# Altium schematic sheet LWIR_FPGA_CSI.SchDoc
size A4
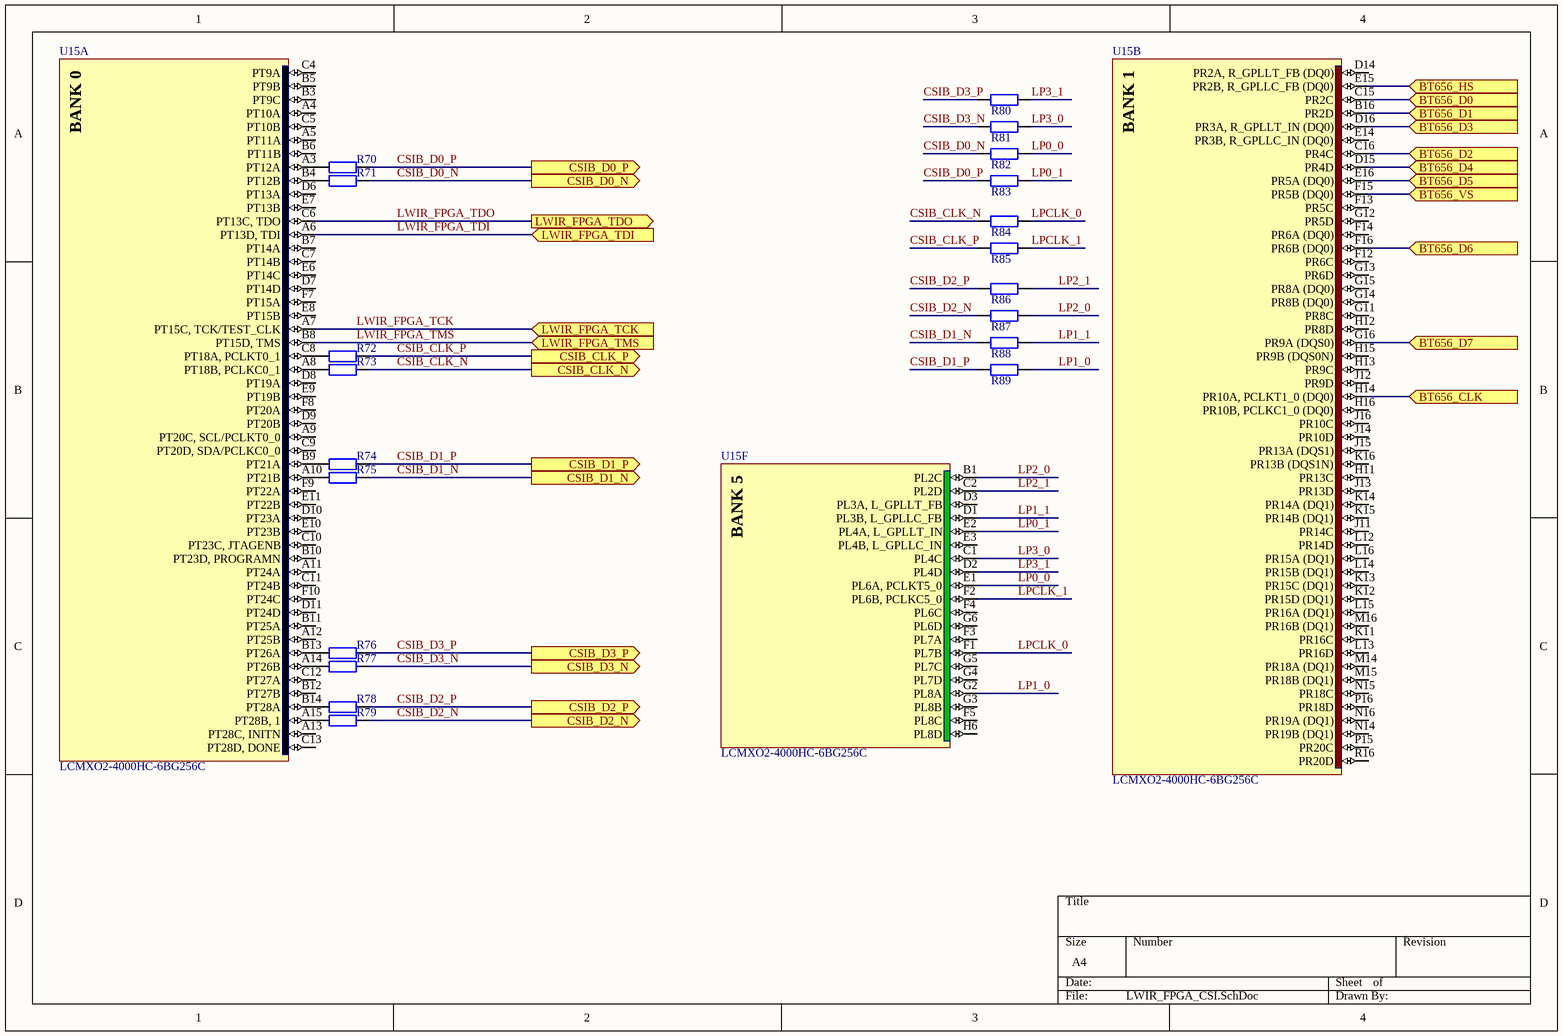
[diagram p0: LWIR_FPGA_CSI.SchDoc]

## Parts
R70  CRCW0402330RFKED  [0402R_M]  (value not drawn)
R71  CRCW0402330RFKED  [0402R_M]  (value not drawn)
R72  CRCW0402330RFKED  [0402R_M]  (value not drawn)
R73  CRCW0402330RFKED  [0402R_M]  (value not drawn)
R74  CRCW0402330RFKED  [0402R_M]  (value not drawn)
R75  CRCW0402330RFKED  [0402R_M]  (value not drawn)
R76  CRCW0402330RFKED  [0402R_M]  (value not drawn)
R77  CRCW0402330RFKED  [0402R_M]  (value not drawn)
R78  CRCW0402330RFKED  [0402R_M]  (value not drawn)
R79  CRCW0402330RFKED  [0402R_M]  (value not drawn)
R80  CRCW040249R9FKED  [0402R_M]  (value not drawn)
R81  CRCW040249R9FKED  [0402R_M]  (value not drawn)
R82  CRCW040249R9FKED  [0402R_M]  (value not drawn)
R83  CRCW040249R9FKED  [0402R_M]  (value not drawn)
R84  CRCW040249R9FKED  [0402R_M]  (value not drawn)
R85  CRCW040249R9FKED  [0402R_M]  (value not drawn)
R86  CRCW040249R9FKED  [0402R_M]  (value not drawn)
R87  CRCW040249R9FKED  [0402R_M]  (value not drawn)
R88  CRCW040249R9FKED  [0402R_M]  (value not drawn)
R89  CRCW040249R9FKED  [0402R_M]  (value not drawn)
U15  LCMXO2-4000HC-6BG256C  [caBGA256]  (parts A,B,F of 8)

## Ports
BT656_CLK (in), BT656_D0 (in), BT656_D1 (in), BT656_D2 (in), BT656_D3 (in), BT656_D4 (in), BT656_D5 (in), BT656_D6 (in), BT656_D7 (in), BT656_HS (in), BT656_VS (in), CSIB_CLK_N (out), CSIB_CLK_P (out), CSIB_D0_N (out), CSIB_D0_P (out), CSIB_D1_N (out), CSIB_D1_P (out), CSIB_D2_N (out), CSIB_D2_P (out), CSIB_D3_N (out), CSIB_D3_P (out), LWIR_FPGA_TCK (in), LWIR_FPGA_TDI (in), LWIR_FPGA_TDO (out), LWIR_FPGA_TMS (in)

## Nets
BT656_CLK: U15.H14(PR10A,_PCLKT1_0_(DQ0)) ; port BT656_CLK
BT656_D0: U15.C15(PR2C) ; port BT656_D0
BT656_D1: U15.B16(PR2D) ; port BT656_D1
BT656_D2: U15.C16(PR4C) ; port BT656_D2
BT656_D3: U15.D16(PR3A,_R_GPLLT_IN_(DQ0)) ; port BT656_D3
BT656_D4: U15.D15(PR4D) ; port BT656_D4
BT656_D5: U15.E16(PR5A_(DQ0)) ; port BT656_D5
BT656_D6: U15.F16(PR6B_(DQ0)) ; port BT656_D6
BT656_D7: U15.G16(PR9A_(DQS0)) ; port BT656_D7
BT656_HS: U15.E15(PR2B,_R_GPLLC_FB_(DQ0)) ; port BT656_HS
BT656_VS: U15.F15(PR5B_(DQ0)) ; port BT656_VS
CSIB_CLK_N: R73.2 R84.1 ; port CSIB_CLK_N
CSIB_CLK_P: R72.2 R85.1 ; port CSIB_CLK_P
CSIB_D0_N: R71.2 R82.1 ; port CSIB_D0_N
CSIB_D0_P: R70.2 R83.1 ; port CSIB_D0_P
CSIB_D1_N: R75.2 R88.2 ; port CSIB_D1_N
CSIB_D1_P: R74.2 R89.2 ; port CSIB_D1_P
CSIB_D2_N: R79.2 R87.2 ; port CSIB_D2_N
CSIB_D2_P: R78.2 R86.2 ; port CSIB_D2_P
CSIB_D3_N: R77.2 R81.1 ; port CSIB_D3_N
CSIB_D3_P: R76.2 R80.1 ; port CSIB_D3_P
LP0_0: R82.2 U15.E1(PL6A,_PCLKT5_0)
LP0_1: R83.2 U15.E2(PL4A,_L_GPLLT_IN)
LP1_0: R89.1 U15.G2(PL8A)
LP1_1: R88.1 U15.D1(PL3B,_L_GPLLC_FB)
LP2_0: R87.1 U15.B1(PL2C)
LP2_1: R86.1 U15.C2(PL2D)
LP3_0: R81.2 U15.C1(PL4C)
LP3_1: R80.2 U15.D2(PL4D)
LPCLK_0: R84.2 U15.F1(PL7B)
LPCLK_1: R85.2 U15.F2(PL6B,_PCLKC5_0)
LWIR_FPGA_TCK: U15.A7(PT15C,_TCK/TEST_CLK) ; port LWIR_FPGA_TCK
LWIR_FPGA_TDI: U15.A6(PT13D,_TDI) ; port LWIR_FPGA_TDI
LWIR_FPGA_TDO: U15.C6(PT13C,_TDO) ; port LWIR_FPGA_TDO
LWIR_FPGA_TMS: U15.B8(PT15D,_TMS) ; port LWIR_FPGA_TMS
NetR70_1: R70.1 U15.A3(PT12A)
NetR71_1: R71.1 U15.B4(PT12B)
NetR72_1: R72.1 U15.C8(PT18A,_PCLKT0_1)
NetR73_1: R73.1 U15.A8(PT18B,_PCLKC0_1)
NetR74_1: R74.1 U15.B9(PT21A)
NetR75_1: R75.1 U15.A10(PT21B)
NetR76_1: R76.1 U15.B13(PT26A)
NetR77_1: R77.1 U15.A14(PT26B)
NetR78_1: R78.1 U15.B14(PT28A)
NetR79_1: R79.1 U15.A15(PT28B,_1)

Not connected (* = marked no-connect by the designer): U15 A4(PT10A) A5(PT11A) A9(PT20C,_SCL/PCLKT0_0) A11(PT24A) A12(PT25B) A13(PT28C,_INITN) B3(PT9C) B5(PT9B) B6(PT11B) B7(PT14A) B10(PT23D,_PROGRAMN) B11(PT25A) B12(PT27B) C4(PT9A) C5(PT10B) C7(PT14B) C9(PT20D,_SDA/PCLKC0_0) C10(PT23C,_JTAGENB) C11(PT24B) C12(PT27A) C13(PT28D,_DONE) D3(PL3A,_L_GPLLT_FB) D6(PT13A) D7(PT14D) D8(PT19A) D9(PT20B) D10(PT23A) D11(PT24D) D14(PR2A,_R_GPLLT_FB_(DQ0)) E3(PL4B,_L_GPLLC_IN) E6(PT14C) E7(PT13B) E8(PT15B) E9(PT19B) E10(PT23B) E11(PT22B) E14(PR3B,_R_GPLLC_IN_(DQ0)) F3(PL7A) F4(PL6C) F5(PL8C) F7(PT15A) F8(PT20A) F9(PT22A) F10(PT24C) F12(PR6C) F13(PR5C) F14(PR6A_(DQ0)) G3(PL8B) G4(PL7D) G5(PL7C) G6(PL6D) G11(PR8C) G12(PR5D) G13(PR6D) G14(PR8B_(DQ0)) G15(PR8A_(DQ0)) H6(PL8D) H11(PR13C) H12(PR8D) H13(PR9C) H15(PR9B_(DQS0N)) H16(PR10B,_PCLKC1_0_(DQ0)) J11(PR14C) J12(PR9D) J13(PR13D) J14(PR10D) J15(PR13A_(DQS1)) J16(PR10C) K11(PR16C) K12(PR15D_(DQ1)) K13(PR15C_(DQ1)) K14(PR14A_(DQ1)) K15(PR14B_(DQ1)) K16(PR13B_(DQS1N)) L12(PR14D) L13(PR16D) L14(PR15B_(DQ1)) L15(PR16A_(DQ1)) L16(PR15A_(DQ1)) M14(PR18A_(DQ1)) M15(PR18B_(DQ1)) M16(PR16B_(DQ1)) N14(PR19B_(DQ1)) N15(PR18C) N16(PR19A_(DQ1)) P15(PR20C) P16(PR18D) R16(PR20D)

## Notes on the sheet
- (in symbol CMP-0111-00181-1, part A) BANK 0
- (in symbol CMP-0111-00181-1, part B) BANK 1
- (in symbol CMP-0111-00181-1, part F) BANK 5

## Library data of the parts
R70-R79 = CRCW0402330RFKED: RES SMD 330 OHM 1% 1/16W 0402; Manufacturer: Vishay Dale; Power (Watts): 0.063W, 1/16W; Temperature Coefficient: ±100ppm/°C; Value: 330R; Supplier 1: Digi-Key; Manufacturer Part Number: CRCW0402330RFKED; RoHS: RoHS Compliant; Category: Resistors; Stock 1: 346239; Pricing 1: 1=0.1, 10=0.037, 100=0.0149, 1000=0.0067, 2500=0.00582, 5000=0.00481 (USD); Packaging: Cut Tape (CT); Part Status: Active; Tolerance: ±1%; Composition: Thick Film; Features: Automotive AEC-Q200; Operating Temperature: -55°C ~ 155°C; Package / Case: 0402 (1005 Metric); Supplier Device Package: 0402; Size / Dimension: 0.039" L x 0.020" W (1.00mm x 0.50mm); Height - Seated (Max): 0.016" (0.40mm); Failure Rate: -; ComponentLink1URL: http://www.vishay.com/docs/20035/dcrcwe3.pdf; ComponentLink1Description: http://www.vishay.com/docs/20035/dcrcwe3.pdf; Supplier Part Number 1: 541-330LCT-ND
R80-R89 = CRCW040249R9FKED: RES SMD 49.9 OHM 1% 1/16W 0402; Manufacturer: Vishay Dale; Power (Watts): 0.063W, 1/16W; Temperature Coefficient: ±100ppm/°C; Supplier 1: Digi-Key; Manufacturer Part Number: CRCW040249R9FKED; RoHS: RoHS Compliant; Category: Resistors; Stock 1: 0; Pricing 1: 1=0.1, 10=0.037, 100=0.0149, 1000=0.0067, 2500=0.00582, 5000=0.00481 (USD); Packaging: Cut Tape (CT); Part Status: Active; Tolerance: ±1%; Composition: Thick Film; Features: Automotive AEC-Q200; Operating Temperature: -55°C ~ 155°C; Package / Case: 0402 (1005 Metric); Supplier Device Package: 0402; Size / Dimension: 0.039" L x 0.020" W (1.00mm x 0.50mm); Height - Seated (Max): 0.016" (0.40mm); Failure Rate: -; ComponentLink1URL: http://www.vishay.com/docs/20035/dcrcwe3.pdf; ComponentLink1Description: http://www.vishay.com/docs/20035/dcrcwe3.pdf; Supplier Part Number 1: 541-49.9LCT-ND
U15 = CMP-0111-00181-1: MachXO2 High Performance CPLD with 4320 LUTs, Voltage Regulator, 2.5V/3.3V, 256-pin caBGA, Speed Grade-6, Commercial Grade, Halogen Free (RoHS); PackageDescription: 256-Ball caBGA Package, 14 x 14 mm Body, 0.8 mm Pitch; DatasheetVersion: ver01.0, Nov-2010; PackageReference: caBGA256; PackageVersion: ver02.6, Nov-2010; Code_JEDEC: MO-275-JJAB-2; PartId: 1